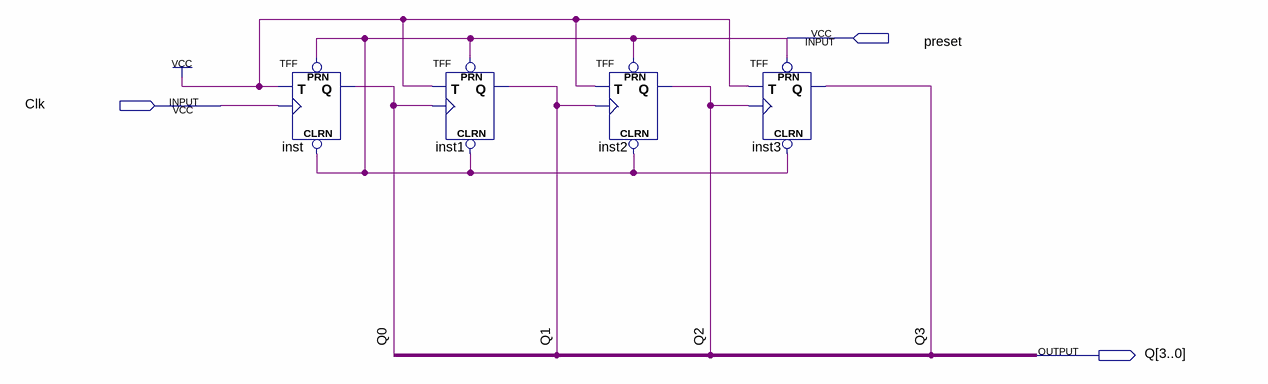
[diagram p0: schematic sheet]
// Quartus schematic lab10step3b.bdf as structural Verilog: 4 symbols, 3 pins
module lab10step3b (
  input  preset,
  input  Clk,
  output [3:0] Q
);

  TFF inst (.PRN(preset), .CLRN(preset), .T(1'b1), .CLK(Clk), .Q(Q[0]));
  TFF inst1 (.PRN(preset), .CLRN(preset), .T(1'b1), .CLK(Q[0]), .Q(Q[1]));
  TFF inst2 (.PRN(preset), .CLRN(preset), .T(1'b1), .CLK(Q[1]), .Q(Q[2]));
  TFF inst3 (.PRN(preset), .CLRN(preset), .T(1'b1), .CLK(Q[2]), .Q(Q[3]));
endmodule
